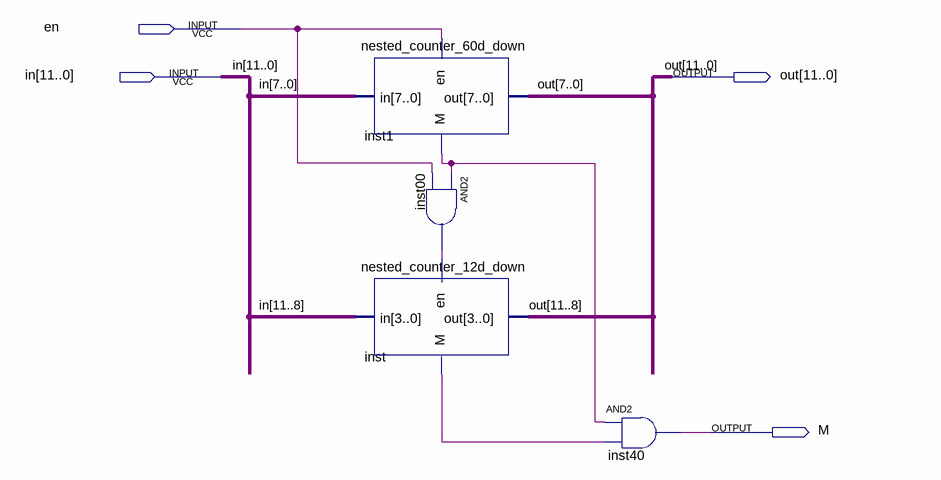
[diagram p0: schematic sheet]
// Quartus schematic nested_counter_clk_down.bdf as structural Verilog: 4 symbols, 4 pins
module nested_counter_clk_down (
  input  en,
  input  [11:0] in,
  output [11:0] out,
  output M
);

  wire inst00_out, inst1_m, inst_m;

  nested_counter_60d_down inst1 (.en(en), .in(in[7:0]), .out(out[7:0]), .M(inst1_m));
  and inst00 (inst00_out, inst1_m, en);
  nested_counter_12d_down inst (.en(inst00_out), .in(in[11:8]), .out(out[11:8]), .M(inst_m));
  and inst40 (M, inst1_m, inst_m);
endmodule
